# Altium schematic sheet sheet1_mcu_radio.SchDoc
size A4
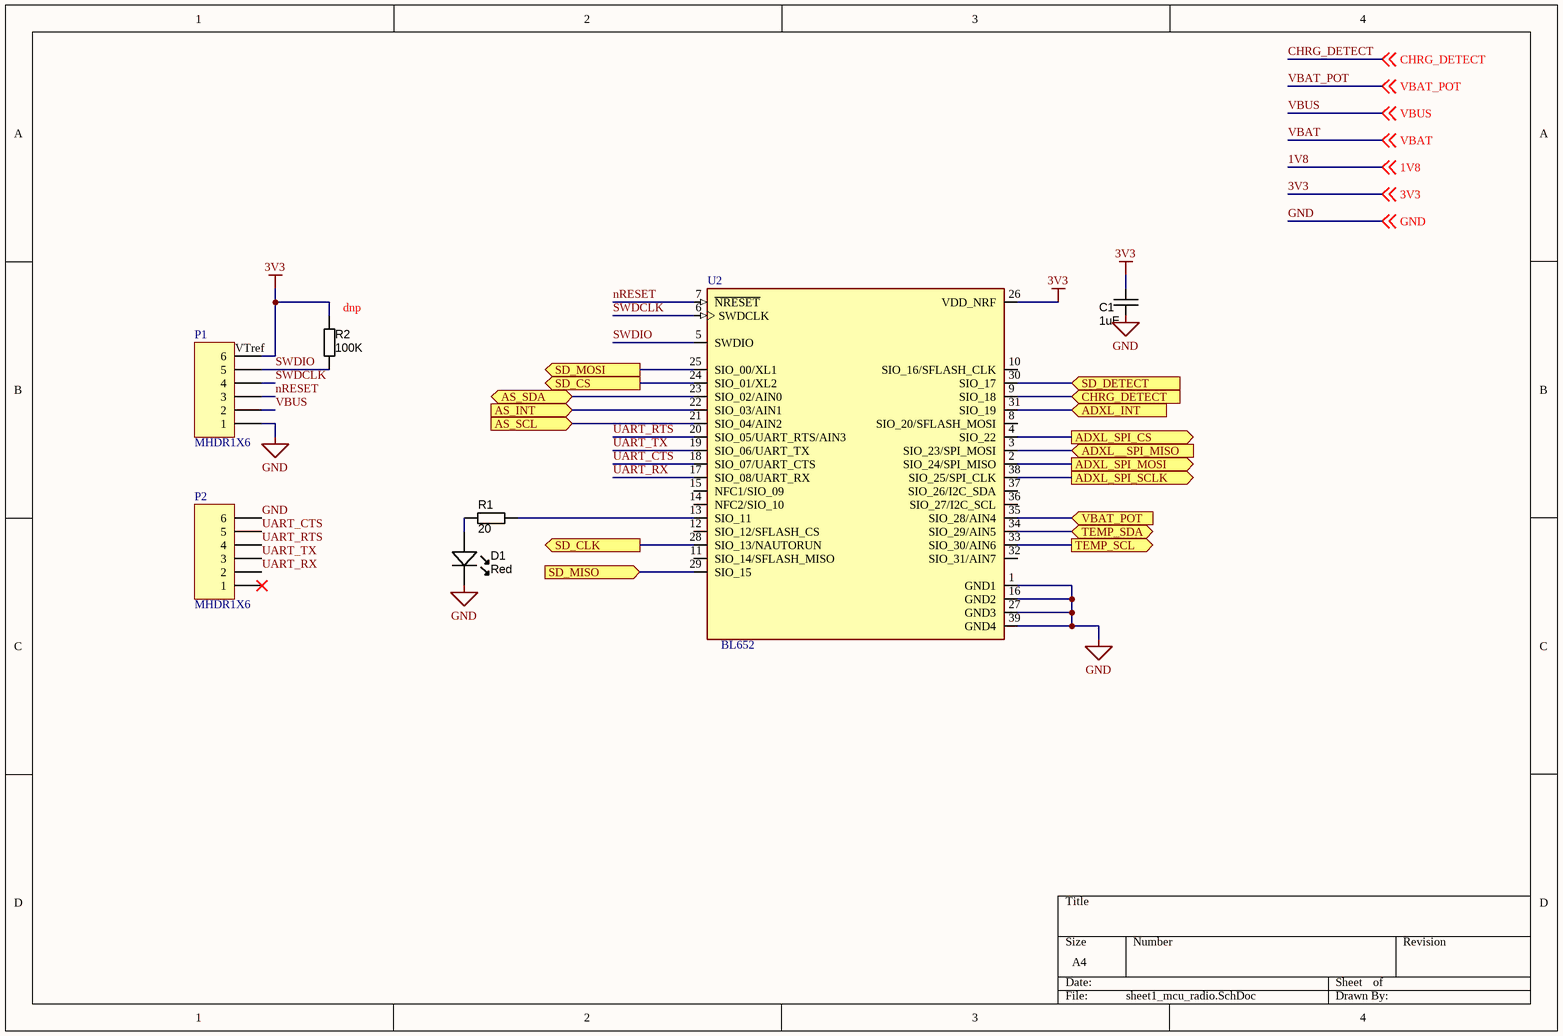
[diagram p0: sheet1_mcu_radio.SchDoc]

## Parts
C1  value 1uF  [CAPC1608X90N]  (hidden comment: approved sub OK)
D1  Red  [LED-0603-RED]
P1  MHDR1X6  [MHDR1X6]
P2  MHDR1X6  [MHDR1X6]
R1  value 20  [RESC1005X40N]  (hidden comment: Thick Film)
R2  value 100K  [RESC1005X40N]  (hidden comment: Thick Film)
U2  BL652  [BL652]

## Ports
ADXL__SPI_MISO (in), ADXL_INT (in), ADXL_SPI_CS (out), ADXL_SPI_MOSI (out), ADXL_SPI_SCLK (out), AS_INT (in), AS_SCL (in), AS_SDA (bidir), CHRG_DETECT (in), SD_CLK (out), SD_CS (out), SD_DETECT (in), SD_MISO (in), SD_MOSI (out), TEMP_SCL (out), TEMP_SDA (bidir), VBAT_POT (in)

## Nets
3V3: C1.1 P1.6 R2.1 U2.26(VDD_NRF) ; off-sheet 3V3
GND: C1.2 D1.K P1.1 P2.6 U2.1(GND1) U2.16(GND2) U2.27(GND3) U2.39(GND4) ; off-sheet GND
1V8: off-sheet 1V8
ADXL__SPI_MISO: U2.3(SIO_23/SPI_MOSI) ; port ADXL__SPI_MISO
ADXL_INT: U2.31(SIO_19) ; port ADXL_INT
ADXL_SPI_CS: U2.4(SIO_22) ; port ADXL_SPI_CS
ADXL_SPI_MOSI: U2.2(SIO_24/SPI_MISO) ; port ADXL_SPI_MOSI
ADXL_SPI_SCLK: U2.38(SIO_25/SPI_CLK) ; port ADXL_SPI_SCLK
AS_INT: U2.22(SIO_03/AIN1) ; port AS_INT
AS_SCL: U2.21(SIO_04/AIN2) ; port AS_SCL
AS_SDA: U2.23(SIO_02/AIN0) ; port AS_SDA
CHRG_DETECT: U2.9(SIO_18) ; port CHRG_DETECT
CHRG_DETECT: off-sheet CHRG_DETECT  [a separate net that carries the same name]
nRESET: P1.3 U2.7(~{NRESET})
SD_CLK: U2.28(SIO_13/NAUTORUN) ; port SD_CLK
SD_CS: U2.24(SIO_01/XL2) ; port SD_CS
SD_DETECT: U2.30(SIO_17) ; port SD_DETECT
SD_MISO: U2.29(SIO_15) ; port SD_MISO
SD_MOSI: U2.25(SIO_00/XL1) ; port SD_MOSI
SWDCLK: P1.4 U2.6(SWDCLK)
SWDIO: P1.5 R2.2 U2.5(SWDIO)
TEMP_SCL: U2.33(SIO_30/AIN6) ; port TEMP_SCL
TEMP_SDA: U2.34(SIO_29/AIN5) ; port TEMP_SDA
UART_CTS: P2.5 U2.18(SIO_07/UART_CTS)
UART_RTS: P2.4 U2.20(SIO_05/UART_RTS/AIN3)
UART_RX: P2.2 U2.17(SIO_08/UART_RX)
UART_TX: P2.3 U2.19(SIO_06/UART_TX)
VBAT: off-sheet VBAT
VBAT_POT: U2.35(SIO_28/AIN4) ; port VBAT_POT
VBAT_POT: off-sheet VBAT_POT  [a separate net that carries the same name]
VBUS: P1.2 ; off-sheet VBUS
NetD1_A: D1.A R1.1
NetR1_2: R1.2 U2.13(SIO_11)

Not connected (* = marked no-connect by the designer): P2 1*; U2 8(SIO_20/SFLASH_MOSI) 10(SIO_16/SFLASH_CLK) 11(SIO_14/SFLASH_MISO) 12(SIO_12/SFLASH_CS) 14(NFC2/SIO_10) 15(NFC1/SIO_09) 32(SIO_31/AIN7) 36(SIO_27/I2C_SCL) 37(SIO_26/I2C_SDA)

## Notes on the sheet
- (near R2) dnp
- (near P1) VTref

## Library data of the parts
C1 = CAPC_100n_0603_X7R_50V_10%: Capacitor SMD Cer 10uF 10% 16V X5R 0603; Manufacturer: TDK; Manufacturer Part Number: C1608X5R1C106M080AB; Ratings: 16V; X5R; Material: ceramic; Package / Case: 0603 (1608 Metric); Tolerance: ±10%; Supplier: Farnell; Supplier Part Number: 2525096; Supplier Link: https://uk.farnell.com/tdk/c1608x5r1c106m080ab/cap-10-f-16v-20-x5r-0603/dp/2525096?st=2521959
D1 = LED_SMD_Red_0603_220mcd: Dialight 598-8E40-107F; Manufacturer 1: Kingbright Company LLC; Manufacturer Part Number 1: APT1608SURCK; Material: AlGaInP on GaAs; Ratings: 220 mcd; 630 nm; Voltage - Forward (Vf) Typ: 1.95V; Voltage - Forward (Vf) @ 10mA: 1.9V; SCDType: source; Package / Case: 0603 (1608 metric); Supplier 1: Digi-Key; Supplier Part Number 1: 754-1123-1-ND; ComponentLink1URL: http://www.us.kingbright.com/images/catalog/SPEC/APT1608SURCK.pdf; ComponentLink1Description: http://www.us.kingbright.com/images/catalog/SPEC/APT1608SURCK.pdf
P1 P2 = MHDR1X6: Header, 6-Pin; LatestRevisionDate: 17-Jul-2002; LatestRevisionNote: Re-released for DXP Platform.; Publisher: Altium Limited
R1 R2 = RES_100K_0402_5%: Resistor SMD chip 100k Ohm 0.063W 5% 0402; Manufacturer 1: Vishay Dale; Manufacturer Part Number 1: CRCW0402100KJNED; Ratings: 1/16 W; SCDType: undef; Package / Case: 0402 (1005 Metric); Tolerance: ±5%; ComponentLink2URL: http://www.yageo.com/documents/recent/PYu-RC0402_51_RoHS_L_6.pdf; ComponentLink2Description: http://www.yageo.com/documents/recent/PYu-RC0402_51_RoHS_L_6.pdf; Supplier 1: Digi-Key; Supplier Part Number 1: 541-100KJCT-ND; ComponentLink1URL: http://www.vishay.com/doc?20035; ComponentLink1Description: http://www.vishay.com/doc?20035; Supplier 2: Digi-Key; Supplier Part Number 2: 311-100KJRCT-ND; Manufacturer 2: Yageo; Manufacturer Part Number 2: RC0402JR-07100KL